# EAGLE board LRA_TestSiteJunctionBox (EAGLE 8.7.1)
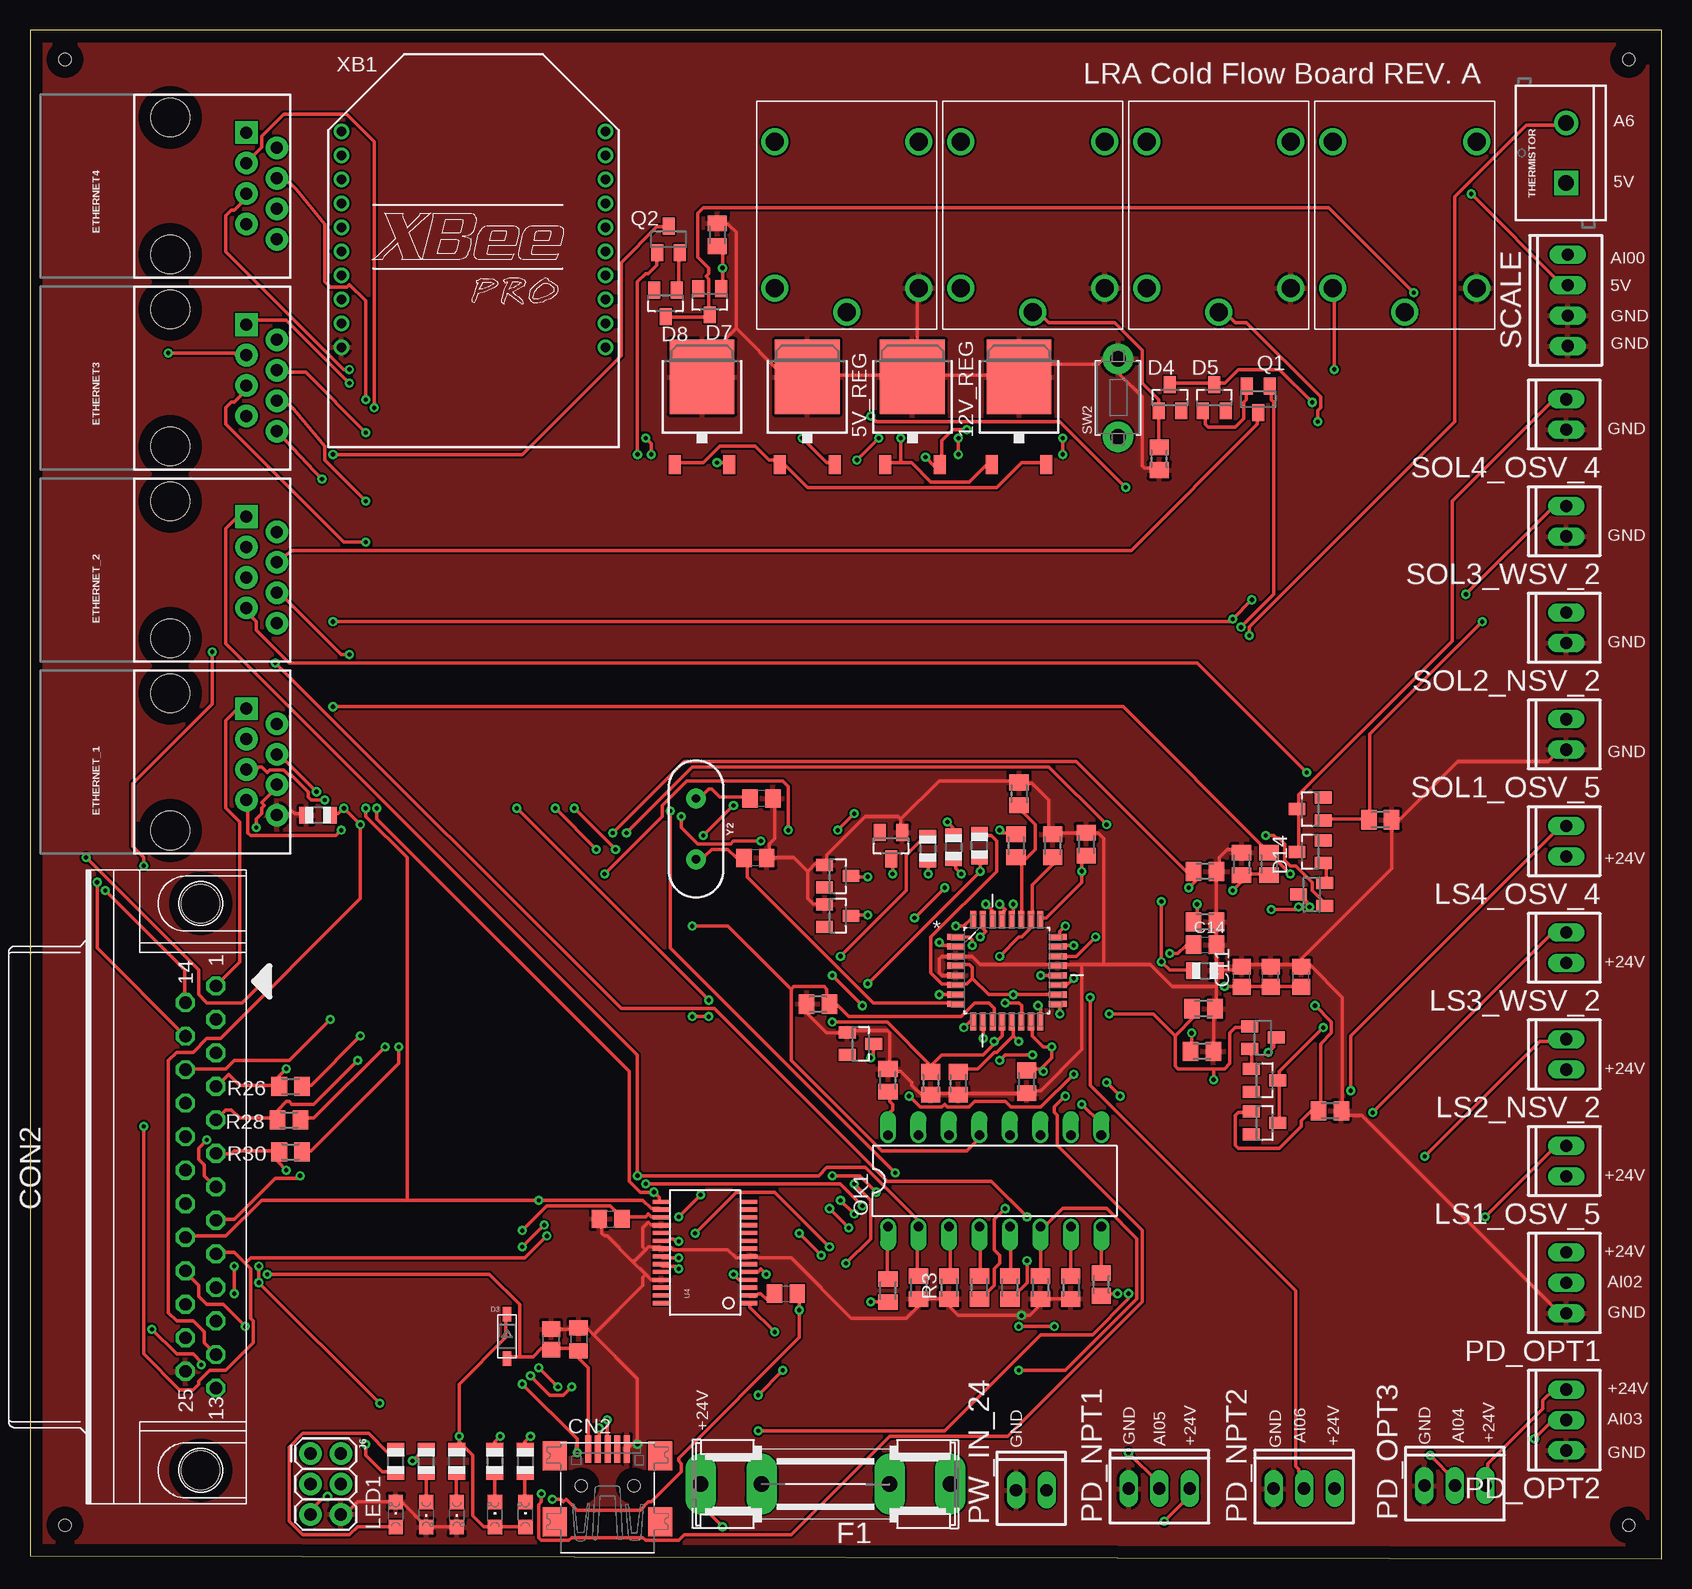
[diagram p2: board, top side]
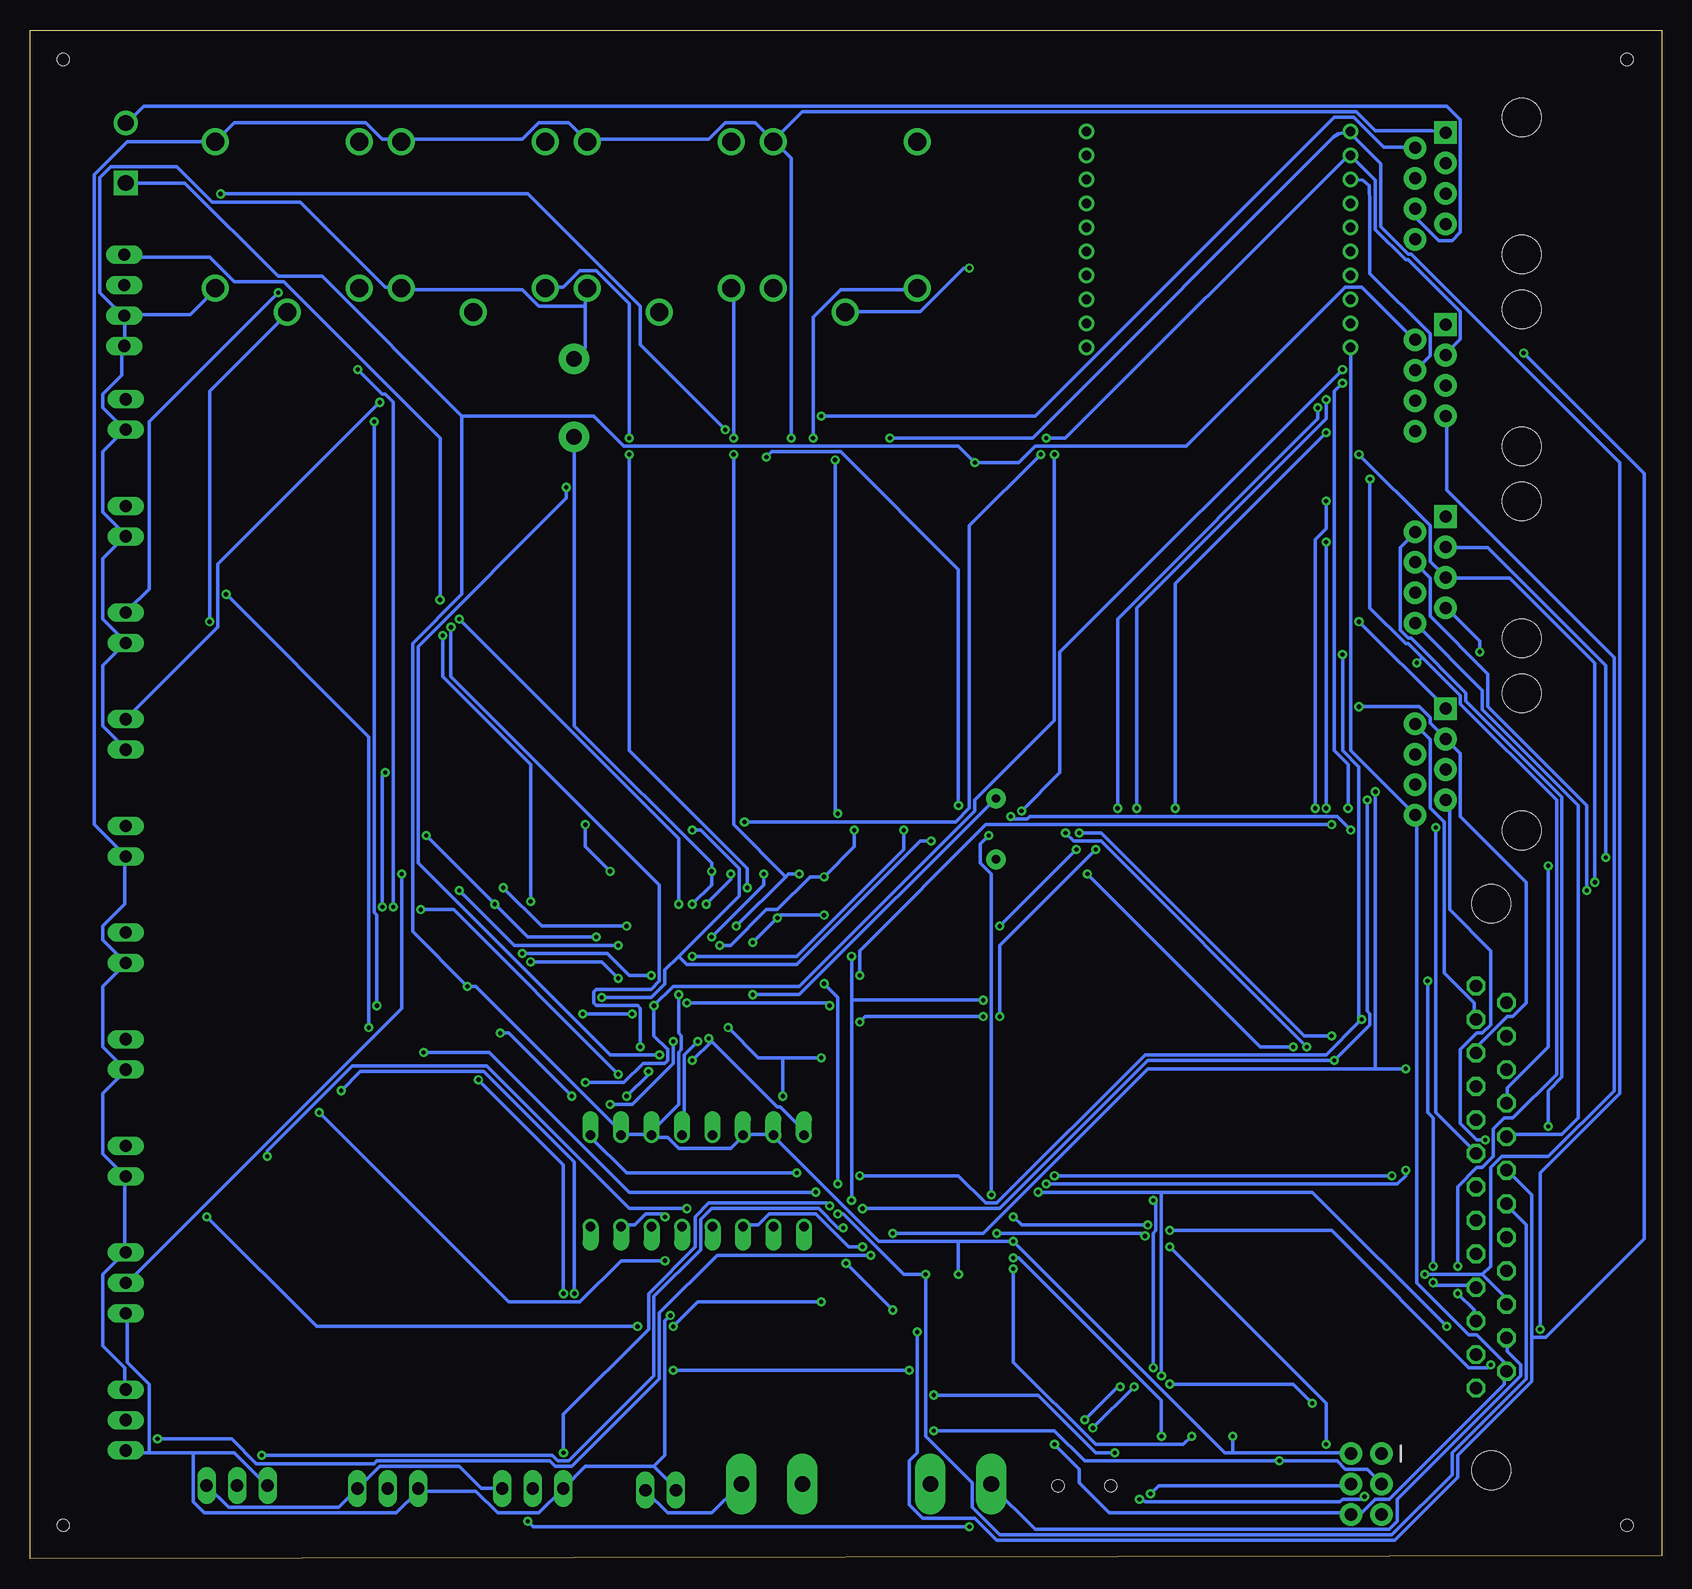
[diagram p3: board, bottom side, seen from below]

Size 136 x 127.43 mm. Coordinates in mm from the lower left corner, seen from the top.
Outline: 0,0.25 136,0 136,127.43 0,127.43 0,0.25
Copper layers (1*16): Top 0.035mm / dielectric 1.5mm / Bottom 0.035mm
Design rules "default": minimum track width 6mil, minimum drill 0.35mm, track to track 6mil, track to pad 6mil, pad to pad 6mil, via to via 6mil, smd to smd 6mil, copper to edge 40mil, drill to drill 6mil, minimum pad ring 10mil, minimum via ring 8mil, stop-mask expansion 4mil, vias tented up to drill 0mil, thermal gap 10mil
Net classes: 0 default: width 0.305 mm; 1 +5V: width 0.61 mm; 2 +12V: width 0.61 mm; 3 5V: width 0.61 mm
Holes 1 mm at 2.92,124.97 133.22,124.97 133.22,2.79 2.92,2.79

## Footprints (pad centres in the part's own frame; a part is rotated, then mirrored left to right if it is on the bottom)
TO252 = smd 1 x 1.6: 1 -2.28,-4.8; 2 2.28,-4.8 | smd 5.4 x 6.2: 3 0,2.5
C0805 = smd 1.3 x 1.5: 1 -0.85,0; 2 0.85,0
0805 = smd 1.27 x 1.524: 1 -0.953,0; 2 0.953,0
USB-MINIB = smd 0.5 x 2.308: D+ 0,4.064; D- -0.8,4.064; GND 1.6,4.064; ID 0.8,4.064; VBUS -1.6,4.064 | smd 2 x 2.4: GND1 -4.4,-2; GND2 -4.4,3.5; GND3 4.4,3.5; GND4 4.4,-2 | hole 1: -2.2,1; 2.2,1
D-25M/90 = drill 1.016 pad 1.575 octagon: 1 16.764,-1.27; 2 13.97,-1.27; 3 11.176,-1.27; 4 8.382,-1.27; 5 5.588,-1.27; 6 2.794,-1.27; 7 0,-1.27; 8 -2.794,-1.27; 9 -5.588,-1.27; 10 -8.382,-1.27; 11 -11.176,-1.27; 12 -13.97,-1.27; 13 -16.764,-1.27; 14 15.367,1.27; 15 12.573,1.27; 16 9.779,1.27; 17 6.985,1.27; 18 4.191,1.27; 19 1.397,1.27; 20 -1.397,1.27; 21 -4.191,1.27; 22 -6.985,1.27; 23 -9.779,1.27; 24 -12.573,1.27; 25 -15.367,1.27 | hole 3.2: 23.622,0; -23.622,0
SOD-123 = smd 1.2 x 0.7: A 1.85,0; C -1.85,0
SOT23 = smd 1 x 1.4: 1 -0.95,-1.1; 2 0.95,-1.1; 3 0,1.1
RJ45-8 = drill 1 pad 1.88 square: 1 -4.445,6.35 | drill 1 pad 1.88: 2 -3.175,8.89; 3 -1.905,6.35; 4 -0.635,8.89; 5 0.635,6.35; 6 1.905,8.89; 7 3.175,6.35; 8 4.445,8.89 | hole 3.2: -5.715,0; 5.715,0
SHK20L = drill 1.321 pad 2.54 long: 1A -10.414,0; 1B -5.334,0; 2A 10.414,0; 2B 5.334,0
2X3 = drill 1.016 pad 1.88: 1 0,0; 2 0,2.54; 3 2.54,0; 4 2.54,2.54; 5 5.08,0; 6 5.08,2.54
CHIPLED_0805 = smd 1.2 x 1.2: A 0,-1.05; C 0,1.05
MTA-100-2V = drill 1.016 long: 1 -1.27,0; 2 1.27,0
DIL16 = drill 0.813 offset: 1 -8.89,-3.81; 2 -6.35,-3.81; 3 -3.81,-3.81; 4 -1.27,-3.81; 5 1.27,-3.81; 6 3.81,-3.81; 7 6.35,-3.81; 8 8.89,-3.81; 9 8.89,3.81; 10 6.35,3.81; 11 3.81,3.81; 12 1.27,3.81; 13 -1.27,3.81; 14 -3.81,3.81; 15 -6.35,3.81; 16 -8.89,3.81
MTA-100-3V = drill 1.016 long: 1 -2.54,0; 2 0,0; 3 2.54,0
M0805 = smd 1.3 x 1.6: 1 -0.95,0; 2 0.95,0
R0805 = smd 1.1 x 1.4: 1 -1,0; 2 1,0
MTA-100-4V = drill 1.016 long: 1 -3.81,0; 2 -1.27,0; 3 1.27,0; 4 3.81,0
TACT_PANA-EVQ = drill 1.3 pad 2.54: P$1 -3.25,0; P$2 3.25,0
SCREWTERMINAL-5MM-2 = drill 1.3 pad 2.032 square: 1 0,0 | drill 1.3 pad 2.032: 2 5,0
QFP80P900X900X120-32N = smd 1.473 x 0.508: 1 -4.242,2.794; 2 -4.242,2.007; 3 -4.242,1.194; 4 -4.242,0.406; 5 -4.242,-0.406; 6 -4.242,-1.194; 7 -4.242,-2.007; 8 -4.242,-2.794; 17 4.242,-2.794; 18 4.242,-2.007; 19 4.242,-1.194; 20 4.242,-0.406; 21 4.242,0.406; 22 4.242,1.194; 23 4.242,2.007; 24 4.242,2.794 | smd 0.508 x 1.473: 9 -2.794,-4.242; 10 -2.007,-4.242; 11 -1.194,-4.242; 12 -0.406,-4.242; 13 0.406,-4.242; 14 1.194,-4.242; 15 2.007,-4.242; 16 2.794,-4.242; 25 2.794,4.242; 26 2.007,4.242; 27 1.194,4.242; 28 0.406,4.242; 29 -0.406,4.242; 30 -1.194,4.242; 31 -2.007,4.242; 32 -2.794,4.242
SSOP28DB = smd 0.348 x 1.397: 1 -4.225,-3.656; 2 -3.575,-3.656; 3 -2.925,-3.656; 4 -2.275,-3.656; 5 -1.625,-3.656; 6 -0.975,-3.656; 7 -0.325,-3.656; 8 0.325,-3.656; 9 0.975,-3.656; 10 1.625,-3.656; 11 2.275,-3.656; 12 2.925,-3.656; 13 3.575,-3.656; 14 4.225,-3.656; 15 4.225,3.656; 16 3.575,3.656; 17 2.925,3.656; 18 2.275,3.656; 19 1.625,3.656; 20 0.975,3.656; 21 0.325,3.656; 22 -0.325,3.656; 23 -0.975,3.656; 24 -1.625,3.656; 25 -2.275,3.656; 26 -2.925,3.656; 27 -3.575,3.656; 28 -4.225,3.656
RW-SH = drill 1.5: 1 -6.1,6; 2 -6.1,-6; COM -8.1,0; NC 6.1,6; NO 6.1,-6
XBEE-PRO = drill 0.8 pad 1.27: 1 -11,9; 2 -11,7; 3 -11,5; 4 -11,3; 5 -11,1; 6 -11,-1; 7 -11,-3; 8 -11,-5; 9 -11,-7; 10 -11,-9; 11 11,-9; 12 11,-7; 13 11,-5; 14 11,-3; 15 11,-1; 16 11,1; 17 11,3; 18 11,5; 19 11,7; 20 11,9
HC49US = drill 0.7 pad 1.651: 1 -2.54,0; 2 2.54,0

## Placement (x,y rotation side)
5V_REG  7824DT  [TO252]  73.53,96.01 0 top
12V_REG  7824DT  [TO252]  82.42,96.01 0 top
C11  0.1uF  [C0805]  100.97,48.51 90 top
C12  15pF  [0805]  60.96,63.37 180 top
C13  15pF  [0805]  60.45,58.42 180 top
C14  0.1uF  [0805]  97.92,51.18 0 top
C15  4.7uF  [C0805]  103.38,48.51 90 top
C16  4.7uF  [C0805]  105.92,48.51 90 top
C17  0.1uF  [0805]  48.39,28.32 0 top
C18  0.1uF  [0805]  62.99,22.1 0 top
C19  4.7uF  [C0805]  43.43,18.29 90 top
C20  0.1uF  [0805]  45.72,18.29 270 top
CN2  [USB-MINIB]  48.13,5.08 0 top
CON2  [D-25M/90]  14.22,30.99 90 top
D3  [SOD-123]  39.75,18.54 270 top
D4  BAS40  [SOT23]  95,96.77 0 top
D5  BAS40  [SOT23]  98.68,96.77 0 top
D6  BAS40  [SOT23]  71.76,59.44 180 top
D7  BAS40  [SOT23]  56.64,104.78 180 top
D8  BAS40  [SOT23]  52.96,104.65 180 top
D9  BAS40  [SOT23]  67.31,56.9 270 top
D10  BAS40  [SOT23]  102.87,36.32 270 top
D11  BAS40  [SOT23]  102.87,39.88 270 top
D12  BAS40  [SOT23]  67.31,53.59 270 top
D13  BAS40  [SOT23]  106.68,62.48 90 top
D14  BAS40  [SOT23]  106.68,58.93 90 top
D15  BAS40  [SOT23]  69.22,42.93 270 top
ETHERNET3  RJ45  [RJ45-8]  11.68,98.43 270 top
ETHERNET4  RJ45  [RJ45-8]  11.68,114.43 270 top
ETHERNET_1  RJ45  [RJ45-8]  11.68,66.42 270 top
ETHERNET_2  RJ45  [RJ45-8]  11.68,82.42 270 top
F1  [SHK20L]  66.29,6.22 180 top
IC1  7824DT  [TO252]  64.77,96.01 0 top
IC2  7824DT  [TO252]  56.01,96.01 0 top
J6  FEMALE 2x3  [2X3]  23.37,8.76 270 top
LED1  [CHIPLED_0805]  30.48,3.68 0 top
LED5  [CHIPLED_0805]  33.02,3.68 180 top
LED6  [CHIPLED_0805]  35.56,3.68 180 top
LED7  [CHIPLED_0805]  41.27,3.68 0 top
LED8  [CHIPLED_0805]  38.73,3.68 0 top
LS1_OSV_5  [MTA-100-2V]  128.02,33.15 90 top
LS2_NSV_2  [MTA-100-2V]  128.02,42.04 90 top
LS3_WSV_2  [MTA-100-2V]  128.02,50.93 90 top
LS4_OSV_4  [MTA-100-2V]  128.02,59.82 90 top
OK1  ILQ1  [DIL16]  80.39,31.5 0 top
PD_NPT1  [MTA-100-3V]  94.11,5.84 0 top
PD_NPT2  [MTA-100-3V]  106.17,5.84 0 top
PD_OPT1  [MTA-100-3V]  128.02,22.99 90 top
PD_OPT2  [MTA-100-3V]  128.02,11.56 90 top
PD_OPT3  [MTA-100-3V]  118.75,6.1 0 top
PW_IN_24  [MTA-100-2V]  83.44,5.71 0 top
Q1  [SOT23]  102.36,96.65 180 top
Q2  [SOT23]  53.21,109.98 0 top
Q3  [SOT23]  102.74,43.43 270 top
Q4  [SOT23]  106.81,55.37 90 top
R1  10k  [M0805]  74.04,22.61 90 top
R2  400  [M0805]  79.12,22.61 270 top
R3  10k  [M0805]  76.58,22.61 90 top
R4  10k  [M0805]  65.66,46.23 0 top
R5  10k  [R0805]  24,61.98 180 top
R6  1k  [R0805]  97.92,49.02 0 top
R7  680  [R0805]  30.48,8.13 90 top
R12  680  [R0805]  79.12,59.44 90 top
R13  100  [R0805]  76.96,59.31 270 top
R14  100  [R0805]  74.8,59.18 270 top
R15  680  [R0805]  33.02,8.13 90 top
R16  680  [R0805]  35.56,8.13 90 top
R17  680  [R0805]  41.27,8.13 270 top
R18  680  [R0805]  38.73,8.13 270 top
R24  3.8K  [M0805]  103.25,57.91 90 top
R25  1K  [M0805]  100.97,57.91 90 top
R26  3.8K  [M0805]  21.72,39.37 180 top
R27  1K  [M0805]  97.92,57.28 0 top
R28  3.8K  [M0805]  21.59,36.58 180 top
R29  1K  [M0805]  88.01,59.56 90 top
R30  3.8K  [M0805]  21.72,33.91 180 top
R31  1K  [M0805]  85.22,59.44 90 top
R32  3.8K  [M0805]  82.17,59.44 90 top
R33  1K  [M0805]  82.42,63.75 90 top
R34  10K  [M0805]  94.11,91.69 270 top
R35  10K  [M0805]  57.28,110.36 90 top
R36  10K  [M0805]  108.33,37.34 0 top
R37  10K  [M0805]  112.52,61.59 0 top
R38  10K  [M0805]  97.66,42.29 0 top
R39  10K  [M0805]  83.06,39.75 270 top
R40  10K  [M0805]  97.79,45.85 0 top
R41  10K  [M0805]  97.92,53.09 0 top
R42  400  [M0805]  71.5,22.35 270 top
R43  10k  [M0805]  71.5,39.88 270 top
R44  400  [M0805]  81.66,22.61 270 top
R45  10k  [M0805]  75.06,39.62 90 top
R46  10k  [M0805]  84.2,22.61 90 top
R47  400  [M0805]  89.28,22.86 270 top
R48  10k  [M0805]  86.74,22.61 90 top
R49  10k  [M0805]  77.34,39.62 90 top
SCALE  [MTA-100-4V]  128.14,104.9 90 top
SOL1_OSV_5  [MTA-100-2V]  128.02,68.71 90 top
SOL2_NSV_2  [MTA-100-2V]  128.02,77.6 90 top
SOL3_WSV_2  [MTA-100-2V]  128.02,86.49 90 top
SOL4_OSV_4  [MTA-100-2V]  128.02,95.38 90 top
SW2  [TACT_PANA-EVQ]  90.68,96.77 90 top
THERMISTOR  [SCREWTERMINAL-5MM-2]  128.02,114.68 90 top
U3  ATMEGA328P-AU  [QFP80P900X900X120-32N]  81.41,49.02 0 top
U4  [SSOP28DB]  56.26,25.53 90 top
U$2  RW-SH  [RW-SH]  83.57,112.01 90 top
U$3  RW-SH  [RW-SH]  68.07,112.01 90 top
U$4  RW-SH  [RW-SH]  99.06,112.01 90 top
U$5  RW-SH  [RW-SH]  114.55,112.01 90 top
XB1  XBEE-PRO  [XBEE-PRO]  36.96,109.98 0 top
Y2  16MHz  [HC49US]  55.5,60.83 270 top

## Tracks (layer width: path | path; a pad name or v marks a point on that pad's centre or on a via)
3.3V  (via drill 0.35)
  Top 0.305: U4.17 52.45,28.5 51.77,28.5 51.54,28.73 51.31,28.5 49.48,28.5 C17.2 49.25,28.5 48.34,29.41 43.08,29.41 v41.02,27.36 | v64.34,93.42 66.4,91.36 66.85,91.36 IC1.2 | v14.27,16.15 14.27,16.38 13.59,17.07 12.22,17.07 v10.16,19.13
  Bottom 0.305: v64.34,93.42 52.45,93.42 27.33,118.54 26.92,118.8 XB1.1 25.42,118.29 23.42,116.28 23.42,111.02 21.13,108.74 20.9,108.74 3.53,91.36 3.53,38.79 10.16,32.16 v10.16,19.13 | v41.02,27.36 27.53,27.36 16.1,15.93 14.5,15.93 v14.27,16.15
5V  (via drill 0.35)
  Top 0.305: v27.99,9.53 27.99,8.61 29.36,7.24 30.28,7.24 R7.1 | v42.85,27.81 v41.02,25.98 | v55.88,30.33 v54.05,28.5 | v58.62,62.79 v56.11,60.27 | v74.62,91.82 75.31,91.14 75.77,91.14 5V_REG.2 76,91.36 76,93.19 76.91,94.11 v78.05,94.11 | v120.12,113.77 127.66,106.22 128.12,106.22 SCALE.3
  Bottom 0.305: v27.99,9.53 27.99,12.95 v41.02,25.98 | v42.85,27.81 53.37,27.81 v54.05,28.5 | v55.88,30.33 55.88,57.07 56.79,57.99 56.79,59.59 v56.11,60.27 | v58.62,62.79 58.62,82.45 68.45,92.28 74.17,92.28 v74.62,91.82 | v120.12,113.77 94.51,113.77 85.14,104.39 85.14,101.19 v78.05,94.11
12V
  Top 0.305: IC2.1 53.82,91.36 56.11,91.36 57.48,92.73 60.45,92.73 61.59,91.59 62.28,91.59 62.51,91.36 IC1.1 62.51,91.14 62.97,91.14 64.8,89.31 80.57,89.31 82.63,91.36 84.68,91.36 12V_REG.2
+5V  (via drill 0.35)
  Top 0.305: v57.25,91.36 58.17,91.36 IC2.2 | R12.2 79.2,60.27 80.11,60.27 80.57,59.82 80.57,57.3 75.08,51.82 75.08,48.84 76,47.93 77.14,47.93 U3.6 77.37,47.93 78.05,47.93 78.51,48.39 | 78.51,48.39 78.51,49.3 78.28,49.53 77.37,49.53 U3.4 | U3.18 v81.94,47.02 79.88,47.02 78.51,48.39 | C16.1 105.72,47.7 103.43,47.7 C15.1 103.2,47.7 101.14,47.7 C11.1 100.91,47.7 v99.54,47.7 | 38.73,2.67 41.25,2.67 LED7.A | 35.76,9.75 35.76,9.3 R16.2 | 35.76,9.75 v35.76,10.21 35.76,14.55 39.65,18.44 39.65,20.27 D3.C | 38.73,2.67 37.82,2.67 36.91,3.58 36.91,8.61 35.76,9.75 | 38.73,2.67 LED8.A | v54.05,26.44 53.82,26.44 53.59,26.67 53.37,26.67 53.14,26.44 52.68,26.44 U4.20 | v58.62,23.7 59.08,23.24 59.77,23.24 U4.4
  Bottom 0.305: ETHERNET3.2 20.68,101.65 25.02,105.99 26.39,105.99 39.65,92.73 52.22,92.73 53.59,91.36 v57.25,91.36 58.62,92.73 86.51,92.73 89.03,95.25 100,95.25 | THERMISTOR.1 123.09,114.68 115.32,106.91 111.66,106.91 100,95.25 | 86.51,35.36 86.74,35.36 OK1.10 86.51,35.36 | 86.51,35.36 84.46,35.36 | 84.46,35.36 84.23,35.36 OK1.11 | 86.51,35.36 98.86,47.7 v99.54,47.7 104.12,52.27 104.12,76.28 100,80.39 100,95.25 | v81.94,47.02 81.94,43.81 81.71,43.59 81.71,42.44 81.94,42.21 81.94,37.87 84.46,35.36 | 84.46,35.36 OK1.11 | 58.62,26.44 65.25,26.44 73.94,35.13 OK1.15 74.17,35.36 76.45,35.36 OK1.14 76.68,35.13 77.6,34.21 81.94,34.21 82.86,35.13 84,35.13 OK1.11 | 58.62,26.44 v54.05,26.44 36.45,8.84 35.76,8.84 | 58.62,26.44 v58.62,23.7 | 35.76,8.84 25.93,8.84 J6.2 | 35.76,8.84 v35.76,10.21
+24V  (via drill 0.35)
  Top 0.305: 72.57,91.36 73.48,91.36 75.08,89.76 78.28,89.76 79.65,91.14 80.11,91.14 12V_REG.1 | 72.57,91.36 71.43,91.36 5V_REG.1 | v72.57,93.42 72.57,91.36 | PD_OPT2.3 126.98,14.1 126.06,13.18 126.06,12.5 121.49,7.92 121.49,6.1 PD_OPT3.3 | F1.2A 55.88,4.5 v57.71,2.67 | v94.51,3.12 96.57,5.18 96.57,5.64 PD_NPT1.3
  Bottom 0.305: ETHERNET4.1 19.18,119.02 23.88,119.02 25.48,120.62 71.65,120.62 73.94,118.34 U$3.NO | U$3.NO 74.17,118.34 75.54,119.71 78.05,119.71 79.43,118.34 89.48,118.34 U$2.NO 89.71,118.34 91.08,119.71 93.6,119.71 94.97,118.34 105.03,118.34 U$4.NO 105.26,118.34 106.63,118.34 108,119.71 118.97,119.71 120.35,118.34 U$5.NO 120.57,118.11 127.89,118.11 130.63,115.37 130.63,61.19 128.12,58.67 LS4_OSV_4.1 128.12,58.45 128.12,54.56 129.95,52.73 129.95,51.59 LS3_WSV_2.1 128.12,49.53 129.95,47.7 129.95,42.67 128.12,40.84 LS2_NSV_2.1 128.12,40.61 129.95,38.79 129.95,33.76 128.12,31.93 LS1_OSV_5.1 128.12,31.7 128.12,25.53 | v72.57,93.42 72.57,116.74 73.94,118.11 U$3.NO | CON2.24 12.9,18.21 12.9,17.3 11.76,16.15 11.76,15.24 22.05,4.95 22.05,3.12 22.73,2.44 52.22,2.44 55.88,6.1 F1.2A | PD_NPT1.3 96.8,5.87 98.4,5.87 100.23,7.7 106.86,7.7 PD_NPT2.3 110.29,4.27 119.43,4.27 121.26,6.1 PD_OPT3.3 | 128.12,25.53 129.95,23.7 129.95,17.75 128.12,15.93 128.12,14.1 PD_OPT2.3 | 128.12,25.53 PD_OPT1.3 | v57.71,2.67 94.06,2.67 v94.51,3.12
ARD_D0_RX  (via drill 0.35)
  Top 0.305: v62.05,18.9 59.99,20.95 59.99,21.18 U4.1 | v76.45,61.42 76.91,60.96 76.91,60.5 R13.1 | v51.77,92.05 51.77,92.96 v51.31,93.42 | v11.53,100.51 17.02,100.51 17.25,100.28 17.93,100.28 ETHERNET3.3
  Bottom 0.305: v62.05,18.9 62.05,8.84 62.74,8.15 62.74,4.5 61.59,3.35 57.25,3.35 55.42,1.52 22.28,1.52 17.02,6.78 17.02,8.61 10.85,14.78 10.85,18.44 | 10.85,18.44 10.85,30.33 12.9,32.38 CON2.19 | v76.45,61.42 58.85,61.42 57.71,62.56 57.71,86.11 v51.77,92.05 | v51.31,93.42 49.71,93.42 26.16,116.97 XB1.2 25.93,116.97 23.88,114.91 23.88,110.8 21.36,108.28 21.13,108.28 16.79,103.94 16.79,101.65 17.93,100.51 ETHERNET3.3 | 10.85,18.44 9.7,18.44 1.47,26.67 1.47,90.45 v11.53,100.51
ARD_D1_TX  (via drill 0.35)
  Top 0.305: v61.37,23.7 60.91,24.16 60.68,23.93 59.99,23.93 U4.5 | v67.54,50.22 73.03,55.7 73.03,58.67 74.4,60.05 74.62,60.05 R14.1 | v68.68,28.73 v67.54,29.87 | v27.99,93.88 22.96,98.91 21.44,98.91 ETHERNET3.4 | v56.57,46.56 v40.56,62.56
  Bottom 0.305: XB1.3 24.92,114.91 24.41,114.45 24.33,112.85 24.33,107.14 19.3,102.11 19.3,100.28 20.45,99.14 ETHERNET3.4 | CON2.20 12.9,29.41 11.3,27.81 11.3,15.01 17.48,8.84 17.48,7.01 22.5,1.98 55.19,1.98 57.48,4.27 57.48,6.32 61.37,10.21 v61.37,23.7 63.2,23.7 68.22,28.73 v68.68,28.73 | v67.54,29.87 67.54,46.56 | 67.54,46.56 v67.54,50.22 | v27.99,93.88 40.56,81.31 v40.56,62.56 | 67.54,46.56 v56.57,46.56
ARD_EN_DAC_DO00  (via drill 0.35)
  Top 0.305: v100.91,77.65 103.66,80.39 103.66,96.39 103.43,96.62 103.43,97.54 Q1.1 | 84.23,40.84 85.14,41.76 v85.14,42.67 84.46,42.67 83.54,43.59 83.54,44.73 U3.15 | 84.23,40.84 83.08,40.84 R39.1 | v42.62,5.41 42.62,4.72 42.39,4.5 42.39,1.75 42.62,1.52 44.91,1.52 45.14,1.75 51.08,1.75 51.31,1.52 54.05,1.52 54.51,1.98 63.42,1.98 71.65,10.21 81.48,10.21 92.69,21.41 92.69,27.36 85.6,34.44 85.6,36.96 85.37,37.19 85.37,37.64 v86.28,38.56 | 84.23,40.84 v84.46,40.61
  Bottom 0.305: v100.91,77.65 100.91,73.53 83.54,56.16 83.54,48.16 84.23,47.47 88.8,47.47 89.03,47.24 89.03,46.33 88.8,46.1 85.37,46.1 85.14,45.87 v85.14,42.67 | v42.62,5.41 41.94,6.1 25.93,6.1 J6.4 | v86.28,38.56 84.46,40.39 v84.46,40.61
ARD_EN_DAC_DO01  (via drill 0.35)
  Top 0.305: v50.62,92.05 50.62,106.45 51.31,107.14 51.54,107.14 52.22,107.82 52.22,108.74 Q2.1 | v84,46.1 84.23,45.87 84.23,44.96 U3.16 | v96.8,43.81 96.8,42.44 R38.1 | v89.71,39.7 v90.86,38.56
  Bottom 0.305: v50.62,92.05 50.62,69.88 57.25,63.25 57.25,62.33 71.88,47.7 82.4,47.7 v84,46.1 84,43.59 82.86,42.44 82.86,41.53 83.08,41.3 84.91,41.3 86.51,39.7 v89.71,39.7 | v96.8,43.81 96.11,43.81 v90.86,38.56
ARD_EN_DAC_DO02  (via drill 0.35)
  Top 0.305: v31.88,8.15 32.79,9.07 33.02,9.07 R15.2 | 98.63,40.84 95.66,40.84 95.43,41.07 95.43,43.59 | 98.63,40.84 99.54,40.84 100,41.3 100,43.81 100.46,44.27 101.6,44.27 Q3.1 | 95.43,43.59 97.03,45.19 97.03,45.64 R40.1 | v85.83,45.41 85.83,46.1 U3.17 | v89.94,45.41 93.6,45.41 95.43,43.59 | v60.68,10.67 76.23,10.67 84.23,18.67 88.57,18.67 91.54,21.64 v91.54,22.1 | 98.63,40.84 v98.63,39.93
  Bottom 0.305: J6.3 23.42,6.32 24.56,7.47 26.39,7.47 27.08,8.15 v31.88,8.15 48.11,8.15 50.62,10.67 v60.68,10.67 | v89.94,45.41 v85.83,45.41 | v91.54,22.1 91.54,32.84 v98.63,39.93
ARD_EN_DAC_DO03  (via drill 0.35)
  Top 0.305: v102.97,60.27 103.66,60.27 103.89,60.05 104.12,60.05 104.57,59.59 104.57,58.22 105.03,57.76 105.49,57.76 106.86,56.39 106.86,55.7 107.77,54.79 107.77,54.56 Q4.1 | v97.26,54.56 97.26,53.42 97.03,53.19 R41.1 | U3.22 87.2,50.22 v88.8,51.82
  Bottom 0.305: v102.97,60.27 v97.26,54.56 94.51,51.82 v88.8,51.82
ARD_LS1_OSV_5_D6  (via drill 0.35)
  Top 0.305: v79.43,43.36 79.43,44.73 U3.10 | R43.2 71.65,38.79 71.65,38.1 71.88,37.87 71.88,37.41 71.65,37.19 71.65,35.36 OK1.16 | v70.05,95.25 70.51,94.79 85.83,94.79 v91.31,89.31 | v83.54,41.99 81.26,41.99 v80.8,41.53
  Bottom 0.305: 79.2,43.13 73.71,37.64 73.48,37.64 71.65,35.81 71.65,35.36 OK1.16 | v70.05,95.25 52.22,95.25 27.3,120.17 25.7,120.17 23.19,117.65 20.68,117.65 ETHERNET4.2 | v91.31,89.31 91.31,88.39 103.66,76.05 103.66,57.99 87.66,41.99 v83.54,41.99 | 79.2,43.13 v80.8,41.53 | 79.2,43.13 v79.43,43.36
ARD_LS2_NSV_2_D7  (via drill 0.35)
  Top 0.305: U3.11 80.34,44.96 80.34,45.87 79.88,46.33 78.74,46.33 77.6,45.19 68.22,45.19 67.31,46.1 66.62,46.1 R4.2 66.4,46.33 66.4,47.47 66.17,47.7 63.65,47.7 63.42,47.47 | 63.42,47.47 63.42,41.53 70.97,33.98 78.05,33.98 78.97,34.9 78.97,35.13 OK1.13 | v28.68,95.94 28.68,118.11 26.39,120.4 21.13,120.4 19.3,118.57 19.3,117.65 18.16,116.51 ETHERNET4.3 | v48.79,59.13 v45.36,62.56 | v55.19,52.73 58.17,52.73 63.42,47.47
  Bottom 0.305: v28.68,95.94 28.68,95.02 45.36,78.33 v45.36,62.56 | v55.19,52.73 v48.79,59.13
ARD_LS3_WSV_2_D8  (via drill 0.35)
  Top 0.305: 80.57,43.13 79.43,41.99 76,41.99 75.08,41.07 | 80.57,43.13 81.03,43.59 81.03,44.73 U3.12 | 75.08,41.07 75.08,40.61 R45.2 75.08,41.07 | 80.57,43.13 v80.34,43.13 | v27.99,96.62 27.99,104.85 26.62,106.22 26.39,105.99 25.02,105.99 24.56,106.45 24.56,111.25 22.17,114.15 21.69,114.66 ETHERNET4.4 | v47.19,59.13 v43.76,62.56 | v56.57,45.19 v55.19,45.19 | v66.85,44.73 71.43,44.73 75.08,41.07
  Bottom 0.305: v80.34,43.13 81.48,41.99 81.48,35.36 OK1.12 | v27.99,96.62 27.99,95.02 43.76,79.25 v43.76,62.56 | v47.19,59.13 55.19,51.13 v55.19,45.19 | v56.57,45.19 66.4,45.19 v66.85,44.73
ARD_LS4_OSV_4_D9  (via drill 0.35)
  Top 0.305: 81.94,43.59 81.94,44.73 U3.13 | 81.94,43.59 80.57,42.21 80.34,42.21 78.97,40.84 77.6,40.84 77.37,40.61 R49.2 | v87.66,37.87 89.26,36.27 89.26,35.36 OK1.9 | 81.94,43.59 v82.4,43.13 | v26.62,99.14 26.16,99.14 16.33,108.97 16.33,111.94 16.79,112.4 17.02,112.4 17.93,113.31 17.93,113.77 ETHERNET4.5 | v53.37,62.33 53.37,50.9 v72.11,32.16
  Bottom 0.305: v87.66,37.87 85.83,37.87 82.4,41.3 v82.4,43.13 | v26.62,99.14 50.16,75.59 50.16,65.53 v53.37,62.33 | v72.11,32.16 86.28,32.16 89.26,35.13 OK1.9
ARD_PD_NPT1_A3  (via drill 0.35)
  Top 0.305: R31.1 85.37,58.45 85.37,57.99 83.54,56.16 83.54,53.42 U3.26 83.31,53.19 83.31,52.5 82.63,51.82 82.4,51.82 v80.8,50.22 | v30.73,42.67 30.73,41.3 23.42,33.98 22.73,33.98 R30.1 | v47.88,57.07 52.68,61.87 52.68,62.79 54.74,64.85 62.74,64.85 63.2,64.39 v63.2,60.73
  Bottom 0.305: v30.73,42.67 33.48,42.67 v47.88,57.07 | v63.2,60.73 63.2,59.13 72.11,50.22 v80.8,50.22
ARD_PD_NPT2_A4
  Top 0.305: 82.4,58.22 82.17,58.45 R32.1 82.4,58.22 | 82.4,58.22 82.63,57.99 82.63,53.42 U3.27 | 82.4,58.22 82.86,58.22 83.77,59.13 83.77,61.19 82.63,62.33 82.63,62.79 R33.1
ARD_PD_OPT1_A0  (via drill 0.35)
  Top 0.305: v86.97,51.13 85.83,51.13 U3.23 | v100.23,55.7 100.91,56.39 100.91,56.84 R25.1 101.14,57.07 103.2,57.07 R24.1
  Bottom 0.305: v86.97,51.13 95.66,51.13 v100.23,55.7
ARD_PD_OPT2_A1  (via drill 0.35)
  Top 0.305: v86.28,52.73 85.83,52.27 85.83,51.82 U3.24 | v96.57,55.93 97.26,56.62 97.26,56.84 97.03,57.07 R27.1 96.8,57.3 96.34,57.3 87.2,66.45 54.51,66.45 v48.56,60.5 | v27.53,43.59 23.42,39.47 22.73,39.47 R26.1
  Bottom 0.305: v86.28,52.73 93.37,52.73 v96.57,55.93 | v27.53,43.59 29.82,43.59 46.74,60.5 v48.56,60.5
ARD_PD_OPT3_A2  (via drill 0.35)
  Top 0.305: U3.25 84.23,53.42 84.68,53.42 87.66,56.39 v87.66,57.3 87.66,58.22 87.88,58.45 R29.1 | v29.59,42.67 23.65,36.73 22.73,36.73 R28.1 | v49.71,60.5 55.19,65.99 84.91,65.99 v89.71,61.19
  Bottom 0.305: v29.59,42.67 46.74,59.82 49.02,59.82 v49.71,60.5 | v89.71,61.19 89.71,59.36 v87.66,57.3
ARD_SOL1_OSV_5_D2  (via drill 0.35)
  Top 0.305: v71.88,57.07 71.88,58.22 D6.3 | v77.14,52.73 77.83,52.73 78.51,53.42 U3.32 | v77.37,92.05 v77.37,93.42
  Bottom 0.305: v71.88,57.07 72.8,57.07 73.03,56.84 | v77.14,52.73 73.03,56.84 | v77.37,93.42 77.37,105.77 U$2.1 | v77.37,92.05 77.37,61.19 73.03,56.84
ARD_SOL2_NSV_2_D3  (via drill 0.35)
  Top 0.305: v69.83,56.84 68.45,56.84 D9.3 | v78.51,51.13 78.51,51.59 78.28,51.82 U3.1 | v68.91,91.59 v70.74,93.42 | v67.31,60.73 v68.68,62.1
  Bottom 0.305: v78.51,51.13 77.6,51.13 74.62,54.1 73.71,54.1 70.97,56.84 v69.83,56.84 67.31,59.36 v67.31,60.73 | v70.74,93.42 70.74,103.48 68.45,105.77 62.28,105.77 U$3.1 | v68.91,91.59 68.91,62.33 v68.68,62.1
ARD_SOL3_WSV_2_D4  (via drill 0.35)
  Top 0.305: v69.83,53.64 68.45,53.64 D12.3 | v75.77,51.36 76,51.13 77.14,51.13 U3.2 | v86.06,92.05 v86.06,93.42 | v73.71,53.42 v76.23,55.93
  Bottom 0.305: v69.83,53.64 73.48,53.64 v73.71,53.42 v75.77,51.36 | v86.06,93.42 86.06,104.62 88.8,107.37 90.17,107.37 91.54,105.99 92.91,105.99 U$4.1 | v86.06,92.05 86.06,67.36 76.23,57.53 v76.23,55.93
ARD_SOL4_OSV_4_D5  (via drill 0.35)
  Top 0.305: v70.05,41.76 70.28,41.99 70.28,42.9 D15.3 | v77.83,44.27 78.51,44.96 U3.9 | v108.69,99.14 108.69,105.77 U$5.1 | v105.72,54.33 105.49,54.1 v103.43,54.1 | v86.97,40.39 84.23,37.64 81.71,37.64 81.26,38.1 78.74,38.1 78.28,37.64 76.45,37.64 76.23,37.87 76,37.64 74.17,37.64 v73.25,38.56
  Bottom 0.305: 73.25,41.76 75.31,41.76 v77.83,44.27 | 73.25,41.76 v70.05,41.76 | v108.69,99.14 106.63,97.08 106.4,97.08 105.72,96.39 v105.72,54.33 | v103.43,54.1 100.69,54.1 v86.97,40.39 | 73.25,41.76 v73.25,38.56
ARD_THERM_A6  (via drill 0.35)
  Top 0.305: v86.97,48.39 86.28,47.7 85.83,47.7 U3.19 | R6.1 96.8,49.07 94.97,49.07 v94.29,49.76 v94.29,54.79 | v101.6,76.96 101.6,77.65 118.75,94.79 118.75,113.54 124.69,119.48 127.89,119.48 THERMISTOR.2
  Bottom 0.305: v94.29,49.76 88.34,49.76 v86.97,48.39 | ETHERNET4.6 20.45,112.4 20.45,111.71 18.62,109.88 17.48,109.88 16.79,110.57 16.79,119.94 17.93,121.08 126.52,121.08 127.89,119.71 THERMISTOR.2 | v94.29,54.79 94.29,66.22 101.6,73.53 v101.6,76.96
AREF  (via drill 0.35)
  Top 0.305: v84.23,48.62 U3.20 | v94.97,50.44 95.66,50.44 96.34,51.13 96.8,51.13 C14.1
  Bottom 0.305: v84.23,48.62 86.06,48.62 87.88,50.44 v94.97,50.44
DAC_AI00/ARD_A5  (via drill 0.35)
  Top 0.305: CON2.1 15.65,47.93 17.48,49.76 17.48,61.42 16.33,62.56 16.33,69.88 17.25,70.79 17.93,70.79 ETHERNET_1.1 | v81.94,54.56 81.94,53.42 U3.28 | v101.83,79.93 v100.23,78.33 100,78.11 v25.25,78.11
  Bottom 0.305: v81.94,54.56 81.94,60.05 v100.23,78.33 | v101.83,79.93 101.83,93.42 114.86,106.45 118.97,106.45 121.03,108.51 128.12,108.51 SCALE.4 | v25.25,78.11 18.16,71.02 ETHERNET_1.1
DAC_AI01
  Bottom 0.305: CON2.2 15.65,44.96 15.65,46.33 18.16,48.84 18.16,61.42 19.3,62.56 19.3,68.28 20.45,69.42 ETHERNET_1.2
DAC_AI02  (via drill 0.35)
  Top 0.305: v105.03,57.07 103.43,58.67 R24.2 103.2,58.9 91.08,71.02 v25.25,71.02
  Bottom 0.305: CON2.3 15.42,42.21 15.42,42.67 12.9,45.19 12.45,45.19 11.3,46.33 11.3,56.39 16.79,61.87 16.79,67.13 17.93,68.28 ETHERNET_1.3 18.16,68.5 19.3,69.65 19.3,70.1 20.22,71.02 v25.25,71.02 | v105.03,57.07 105.03,45.87 127.89,23.01 PD_OPT1.2
DAC_AI03  (via drill 0.35)
  Top 0.305: 20.68,39.47 17.48,39.47 16.56,40.39 15.65,39.47 CON2.4 | v125.37,9.98 126.75,11.35 127.89,11.35 PD_OPT2.2 | v64.11,27.13 v65.94,25.3 | v21.36,40.84 20.68,40.16 20.68,39.47 | 20.68,39.47 R26.2 | v23.88,63.93 20.9,66.9 20.68,66.9 ETHERNET_1.4
  Bottom 0.305: v125.37,9.98 119.2,9.98 117.15,7.92 107.32,7.92 107.09,8.15 92.69,8.15 92.23,7.7 90.86,7.7 83.54,15.01 83.54,20.5 78.74,25.3 v65.94,25.3 | v64.11,27.13 56.57,27.13 42.85,40.84 23.88,40.84 | v21.36,40.84 23.88,40.84 | 23.88,40.84 v23.88,63.93
DAC_AI04  (via drill 0.35)
  Top 0.305: CON2.5 16.33,37.41 16.79,37.41 17.48,36.73 20.45,36.73 R28.2 20.68,36.73 20.68,37.41 21.36,38.1 21.59,38.1 21.82,37.87 23.65,37.87 v27.3,41.53 | PD_OPT3.2 118.75,6.55 v116.69,8.61 | v66.62,29.19 v68.22,27.58 | v24.56,63.25 23.42,63.25 23.19,63.48 23.19,63.93 21.82,65.3 21.59,65.3 21.13,65.76 19.99,65.76 19.76,65.53 19.3,65.99 19.07,65.99 18.85,65.76 18.16,65.76 ETHERNET_1.5
  Bottom 0.305: v116.69,8.61 92.46,8.61 92,8.15 91.08,8.15 84,15.24 84,21.87 80.11,25.76 80.11,28.27 79.2,29.19 70.28,29.19 68.68,27.58 v68.22,27.58 | v66.62,29.19 55.19,29.19 42.85,41.53 v27.3,41.53 24.33,44.5 24.33,45.41 24.56,45.64 v24.56,63.25
DAC_AI05  (via drill 0.35)
  Top 0.305: CON2.6 15.65,33.76 16.79,33.76 17.02,33.98 20.68,33.98 R30.2 20.68,33.76 20.68,33.07 v21.36,32.38 | v91.54,8.84 94.06,6.32 94.06,5.87 PD_NPT1.2 | v69.37,29.41 67.54,31.24 v51.31,31.24 | v18.85,60.96 18.85,61.65 19.3,62.1 19.3,62.56 19.53,62.79 19.3,63.02 20.45,64.16 20.45,64.39 ETHERNET_1.6
  Bottom 0.305: v91.54,8.84 91.54,12.04 84.46,19.13 84.46,22.1 80.57,25.98 80.57,28.5 79.43,29.64 69.6,29.64 v69.37,29.41 | v51.31,31.24 22.05,31.24 21.36,31.93 v21.36,32.38 | v18.85,60.96 18.85,37.19 15.65,33.98 CON2.6
DAC_AI06  (via drill 0.35)
  Top 0.305: v14.73,34.9 14.05,34.21 14.05,33.3 14.5,32.84 14.5,31.93 15.42,31.01 CON2.7 | v80.8,60.73 81.03,60.5 82.17,60.5 R32.2 | v88.34,46.79 88.34,39.47 105.49,22.33 105.49,7.7 105.72,7.47 105.72,7.24 106.17,6.78 PD_NPT2.2 | v25.93,60.73 25.48,60.27 18.39,60.27 18.16,60.5 18.16,63.25 ETHERNET_1.7 | v54.28,61.87 54.28,60.96 55.65,59.59 58.39,59.59 58.62,59.82 v60.91,59.82
  Bottom 0.305: v14.73,34.9 15.42,34.9 16.79,36.27 16.79,42.44 15.42,43.81 14.96,43.81 14.27,44.5 14.27,50.67 17.7,54.1 17.7,63.02 17.93,63.25 ETHERNET_1.7 | v80.8,60.73 80.11,60.73 76.91,57.53 76.91,55.24 81.94,50.22 | 81.94,50.22 83.08,49.07 83.08,47.93 84.23,46.79 v88.34,46.79 | v25.93,60.73 27.08,61.87 52.68,61.87 52.91,61.65 54.05,61.65 v54.28,61.87 | v60.91,59.82 61.82,59.82 72.11,49.53 81.26,49.53 81.94,50.22
DAC_DI00  (via drill 0.35)
  Top 0.305: R1.2 73.94,23.7 73.94,27.58 OK1.2 73.94,27.81 73.94,28.27 69.6,32.61 66.4,32.61 65.71,31.93 v50.62,31.93 50.62,41.99 16.33,76.28 16.33,85.88 17.25,86.79 17.93,86.79 ETHERNET_2.1 | v22.5,31.93 22.28,31.7 20.45,31.7 17.02,28.27 15.65,28.27 CON2.8
  Bottom 0.305: v50.62,31.93 v22.5,31.93
DAC_DI01  (via drill 0.35)
  Top 0.305: R3.2 76.68,23.7 76.68,27.58 OK1.3 | 17.93,24.61 18.39,24.16 18.39,20.04 18.62,19.81 18.62,17.98 16.33,15.7 14.96,15.7 14.05,14.78 14.05,14.55 13.59,14.1 12.45,14.1 9.47,17.07 v9.47,36.04 | 17.93,24.61 17.02,25.53 15.65,25.53 CON2.9 | v66.62,25.98 62.05,30.56 58.85,30.56 v55.42,27.13 | v43.08,26.9 41.25,25.07 18.39,25.07 17.93,24.61
  Bottom 0.305: v9.47,36.04 9.47,39.01 8.33,40.16 8.33,63.48 16.33,71.48 16.33,72.16 20.9,76.73 21.13,76.73 21.82,77.42 21.82,84.28 20.68,85.42 ETHERNET_2.2 | v66.62,25.98 67.77,25.98 70.51,28.73 74.4,28.73 75.31,27.81 76.45,27.81 OK1.3 | v55.42,27.13 43.31,27.13 v43.08,26.9
DAC_DI02  (via drill 0.35)
  Top 0.305: R46.2 84.23,23.7 84.23,27.58 OK1.6 84.23,27.81 84.68,27.81 86.06,29.19 89.71,29.19 92.23,26.67 92.23,21.64 86.28,15.7 v82.4,15.7 | v19.07,24.38 v19.07,23.01 v29.13,12.95 | v19.53,48.16 17.7,46.33 14.73,46.33 14.05,47.02 14.05,49.07 v4.67,58.45 | v60.68,13.64 v62.74,15.7 | v45.59,8.84 45.59,9.98 v41.02,14.55
  Bottom 0.305: v19.07,23.01 18.85,22.78 15.65,22.78 CON2.10 | v19.07,24.38 19.07,36.73 19.53,37.19 v19.53,48.16 | v4.67,58.45 4.67,74.45 14.5,84.28 17.93,84.28 ETHERNET_2.3 | v62.74,15.7 v82.4,15.7 | v60.68,13.64 51.99,13.64 47.19,8.84 v45.59,8.84 | v41.02,14.55 30.73,14.55 v29.13,12.95
DAC_DI03  (via drill 0.35)
  Top 0.305: OK1.7 R48.2 | v17.02,24.38 v17.02,22.1 | v24.33,89.99 20.7,93.88 ETHERNET3.8 | v83.08,28.5 80.11,31.47 71.43,31.47 57.02,45.87 49.25,45.87 v20.45,74.68
  Bottom 0.305: v17.02,22.1 15.65,20.73 15.65,19.81 CON2.11 | v17.02,24.38 17.02,31.01 15.42,32.61 14.96,32.61 14.05,33.53 14.05,35.81 13.13,36.73 12.45,36.73 8.79,40.39 8.79,63.25 16.79,71.25 16.79,71.93 19.99,75.13 | 19.99,75.13 21.13,76.28 21.36,76.28 24.33,79.25 v24.33,89.99 | v83.08,28.5 83.31,28.73 84.68,28.73 85.6,27.81 86.74,27.81 OK1.7 | 19.99,75.13 v20.45,74.68
DAC_DO00  (via drill 0.35)
  Top 0.305: Q1.3 102.29,95.48 102.29,94.56 91.77,84.05 21.82,84.05 20.68,83.16 ETHERNET_2.4 | v6.27,55.7 12.9,49.07 12.9,46.56 CON2.14
  Bottom 0.305: v6.27,55.7 6.27,62.79 14.5,71.02 14.5,73.76 19.3,78.56 19.3,81.76 20.45,82.91 ETHERNET_2.4
DAC_DO01  (via drill 0.35)
  Top 0.305: v25.25,92.05 41.02,92.05 49.25,100.28 49.25,108.05 52.22,111.02 53.14,111.02 Q2.3 | v5.59,56.39 5.59,50.9 12.9,43.59 CON2.15
  Bottom 0.305: v25.25,92.05 19.3,86.11 19.3,83.13 18.16,81.99 ETHERNET_2.5 17.93,81.76 12.68,81.76 5.59,74.68 v5.59,56.39
DAC_DO02  (via drill 0.35)
  Top 0.305: v103.2,42.21 103.66,42.67 103.66,43.36 Q3.3 | v70.51,30.56 69.14,31.93 v66.85,31.93 | v25.02,44.96 21.59,41.53 17.02,41.53 16.33,40.84 13.13,40.84 CON2.16 | v26.62,75.36 25.93,75.36 20.9,80.39 20.68,80.39 ETHERNET_2.6
  Bottom 0.305: v103.2,42.21 97.71,42.21 86.06,30.56 v70.51,30.56 | v66.85,31.93 58.62,31.93 56.34,29.64 55.42,29.64 43.08,41.99 27.99,41.99 25.25,44.73 | v26.62,75.36 26.62,67.36 25.25,65.99 25.25,44.73 | 25.25,44.73 v25.02,44.96
DAC_DO03  (via drill 0.35)
  Top 0.305: v106.63,54.33 106.4,54.56 106.4,54.79 105.94,55.24 105.72,55.24 Q4.3 | v106.4,65.53 97.26,74.68 21.59,74.68 18.85,77.42 18.85,78.11 18.16,78.79 18.16,79.25 ETHERNET_2.7 | v9.47,57.76 9.47,58.45 8.56,59.36 8.56,64.62 15.19,71.25 v15.19,75.59
  Bottom 0.305: v106.63,54.33 106.63,65.3 v106.4,65.53 | v9.47,57.76 9.47,42.67 12.9,39.24 12.9,38.1 CON2.17 | v15.19,75.59 15.19,76.51 17.93,79.25 ETHERNET_2.7
DAC_DO04
  Bottom 0.305: CON2.18 12.9,35.36 8.33,35.36 6.96,36.73 6.96,62.79 14.96,70.79 14.96,72.39 20.45,77.88 ETHERNET_2.8
GND  (via drill 0.35)
  Top 0.305: 33.02,2.67 35.53,2.67 LED6.C | 33.02,2.67 30.96,4.72 30.5,4.72 LED1.C 30.28,4.72 27.3,4.72 26.39,3.81 25.93,3.81 J6.6 | 33.02,2.67 LED5.C | R5.2 22.96,62.1 22.05,62.1 21.82,62.33 21.36,61.87 20.68,61.87 ETHERNET_1.8 | C19.2 43.54,19.13 45.59,19.13 C20.1 45.82,19.13 46.51,19.13 46.96,18.67 | 50.39,9.75 50.62,9.98 50.62,15.01 46.96,18.67 | 50.39,9.75 49.94,9.3 CN2.GND | R48.1 84.23,21.64 R46.1 84,21.64 84,20.95 83.31,20.27 v82.63,20.27 77.37,20.27 76.68,20.95 76.68,21.64 R3.1 76.45,21.64 74.17,21.64 R1.1 73.94,21.64 73.94,20.95 73.03,20.04 68.45,20.04 63.42,25.07 60.68,25.07 60.45,25.3 59.99,25.3 U4.7 59.77,25.07 58.85,25.07 58.17,25.76 53.59,25.76 53.37,25.98 53.14,25.76 52.68,25.76 U4.21 52.45,25.98 51.54,25.98 51.31,25.76 | 50.16,24.84 48.11,26.9 47.88,26.9 47.65,27.13 47.65,28.27 C17.1 | 50.16,24.84 51.31,23.7 | 51.31,23.7 51.77,23.24 52.45,23.24 U4.25 | 51.31,25.76 50.39,24.84 50.16,24.84 | 51.31,25.76 51.08,25.98 51.08,27.58 51.54,28.04 51.77,27.81 52.45,27.81 U4.18 | 46.96,18.67 51.08,22.78 51.08,23.47 51.31,23.7 | R34.2 94.06,90.91 92.91,90.91 92.69,91.14 92.69,96.85 90.86,98.68 90.86,99.82 SW2.P$2 90.63,100.05 89.48,100.05 89.03,99.59 83.54,99.59 82.63,98.68 12V_REG.3 82.4,98.68 73.71,98.68 | 73.71,98.68 73.94,98.91 73.94,105.77 U$3.2 | 73.71,98.68 5V_REG.3 73.48,98.68 64.8,98.68 IC1.3 64.57,98.68 62.74,98.68 58.85,102.57 | 58.85,102.57 58.85,110.57 58.17,111.25 57.48,111.25 R35.2 | 58.85,102.57 56.11,99.82 56.11,98.68 IC2.3 | 64.8,57.3 64.8,55.02 65.25,54.56 66.17,54.56 D12.1 | 64.8,57.3 65.48,57.99 66.17,57.99 D9.1 66.4,57.99 66.4,58.67 69.6,61.87 72.34,61.87 72.57,61.65
  Top 0.305: 72.57,61.65 72.57,60.73 D6.1 | 61.59,58.45 63.65,58.45 64.8,57.3 | 61.59,58.45 61.59,59.59 62.05,60.05 62.05,63.25 C12.1 | 61.59,58.45 C13.1 | 72.57,61.65 75.77,64.85 82.4,64.85 R33.2 82.63,64.62 83.54,64.62 84.91,63.25 84.91,60.73 85.14,60.5 R31.2 85.37,60.5 87.88,60.5 R29.2 88.11,60.5 89.03,60.5 89.48,60.05 89.48,49.53 | 105.49,49.53 105.72,49.53 C16.2 | 105.49,49.53 103.43,49.53 C15.2 103.2,49.53 101.14,49.53 C11.2 100.91,49.3 100.69,49.07 99.09,49.07 R6.2 | C16.2 105.94,49.53 106.63,49.53 109.37,46.79 109.37,37.41 R36.2 109.37,37.19 109.6,36.96 110.97,36.96 127.43,20.5 127.89,20.5 PD_OPT1.1 | 105.49,49.53 113.49,57.53 113.49,61.42 R37.2 113.49,61.65 114.17,61.65 118.97,66.45 126.52,66.45 127.43,67.36 127.89,67.36 SOL1_OSV_5.1 | 105.49,49.53 C16.2 | R4.1 64.8,46.1 64.8,45.41 66.4,43.81 68,43.81 D15.1 68.22,44.04 71.43,44.04 71.65,43.81 71.65,40.84 R43.1 71.65,40.61 72.57,40.61 73.48,39.7 73.48,39.47 74.4,38.56 74.85,38.56 R45.1 75.08,38.79 77.14,38.79 R49.1 77.37,38.79 82.86,38.79 R39.2 83.08,39.01 84.23,39.01 87.66,42.44 87.66,49.53 | U3.5 76,48.62 75.77,48.84 75.77,49.99 76,50.22 U3.3 78.51,50.22 79.2,49.53 85.6,49.53 U3.21 85.83,49.53 87.66,49.53 | R25.2 100.91,58.9 100.69,59.13 99.77,59.13 99.09,58.45 99.09,57.3 R27.2 98.86,57.07 98.86,53.19 R41.2 98.86,52.96 98.86,51.36 C14.2 98.86,51.13 98.86,49.07 R6.2 | R38.2 98.63,42.44 98.63,45.64 R40.2 98.86,45.87 98.86,47.7 | 98.86,47.7 98.86,48.84 R6.2 | 89.48,49.53 93.37,49.53 95.2,47.7 98.86,47.7 | 89.48,49.53 87.66,49.53 | 50.39,9.75 v50.62,9.53
  Bottom 0.305: XB1.10 25.93,100.97 25.93,67.36 20.68,62.1 ETHERNET_1.8 20.45,61.87 20.45,23.01 16.1,18.67 15.42,18.67 13.13,16.38 13.13,15.7 CON2.25 13.13,15.47 13.13,14.55 22.73,4.95 23.88,4.95 25.02,3.81 25.7,3.81 J6.6 25.93,3.81 46.05,3.81 48.56,6.32 48.56,7.47 v50.62,9.53 | 84,7.7 82.17,5.87 PW_IN_24.1 | 84,7.7 89.71,7.7 PD_NPT1.1 93.6,3.81 97.03,3.81 98.86,5.64 103.43,5.64 PD_NPT2.1 103.66,5.64 105.49,3.81 121.49,3.81 122.4,4.72 122.4,8.84 | 126.06,8.84 127.89,8.84 PD_OPT2.1 | 126.06,8.84 122.4,8.84 | 122.4,8.84 118.97,8.84 116.23,6.1 PD_OPT3.1 | 126.06,8.84 126.06,14.55 127.89,16.38 127.89,20.27 PD_OPT1.1 | v82.63,20.27 83.08,19.81 83.08,8.61 84,7.7 | 89.71,104.39 89.71,100.97 90.63,100.05 SW2.P$2 | 89.71,104.39 89.71,105.77 U$2.2 | 89.71,104.39 93.6,104.39 94.97,105.77 105.03,105.77 U$4.2 105.26,105.99 106.4,105.99 113.49,113.08 120.8,113.08 123.77,116.05 129.26,116.05 130.17,115.14 130.17,105.54 128.35,103.71 SCALE.2 | SCALE.2 128.12,103.48 128.12,101.19 SCALE.1 128.35,100.97 128.35,98.68 129.95,97.08 129.95,95.94 128.12,94.11 | SCALE.2 128.12,103.71 122.63,103.71 120.57,105.77 U$5.2 | SOL1_OSV_5.1 128.12,67.59 129.95,69.42 129.95,74.45 128.12,76.28 SOL2_NSV_2.1 128.12,76.51 129.95,78.33 129.95,83.36 128.12,85.19 SOL3_WSV_2.1 128.12,85.42 129.95,87.25 129.95,92.28 128.12,94.11 | 128.12,94.11 SOL4_OSV_4.1
  pour Top: 0.38,0.25 0.13,127.25 135.76,127.25 135.76,0.25
KEY_SW-  (via drill 0.35)
  Top 0.305: v26.62,97.99 21.36,103.25 18.39,103.25 18.16,103.02 ETHERNET3.1 | R5.1 25.02,62.1 25.7,62.1 v26.16,62.56 v27.53,61.19 27.53,55.02 15.88,43.36 14.73,43.36 13.59,42.21 12.22,42.21 11.53,41.53 11.53,20.5 12.22,19.81 13.59,19.81 14.5,18.9 14.5,17.98 15.42,17.07 CON2.12 | v81.26,46.33 82.4,46.33 82.63,46.1 82.63,44.96 U3.14 | v66.85,48.62 v69.37,46.1
  Bottom 0.305: v26.16,62.56 26.16,66.22 27.3,67.36 27.3,97.31 v26.62,97.99 | v81.26,46.33 69.6,46.33 v69.37,46.1 | v66.85,48.62 66.85,50.67 56.34,61.19 v27.53,61.19
N$1
  Bottom 0.305: PW_IN_24.2 84.68,5.64 82.86,3.81 79.2,3.81 76.91,6.1 F1.1A
N$2
  Top 0.305: LED1.A 30.28,2.67 27.3,2.67 26.62,1.98 22.73,1.98 21.59,3.12 21.59,9.3 22.73,10.44 28.22,10.44 29.82,8.84 30.05,8.84 30.28,9.07 R7.2
N$3
  Top 0.305: R42.1 71.43,23.47 71.43,27.58 OK1.1
N$5
  Top 0.305: LED6.A 35.53,4.95 35.53,7.01 R16.1
N$6
  Top 0.305: R15.1 LED5.A
N$7  (via drill 0.35)
  Top 0.305: D4.3 95.2,97.99 98.63,97.99 D5.3 98.86,97.99 99.54,97.99 100.69,99.14 104.12,99.14 v106.86,96.39
  Bottom 0.305: v106.86,96.39 120.35,82.91 120.35,77.65 SOL1_OSV_5.2
N$8  (via drill 0.35)
  Top 0.305: D8.3 53.14,103.48 56.57,103.48 D7.3 56.57,103.71 56.57,106.68 56.34,106.91 56.57,107.14 56.57,107.59 55.65,108.51 55.65,112.17 56.11,112.62 108.23,112.62 v115.32,105.54
  Bottom 0.305: v115.32,105.54 126.06,94.79 126.06,80.85 127.89,79.02 SOL2_NSV_2.2
N$9
  Top 0.305: R34.1 94.06,92.73 94.06,95.48 D4.1 94.06,95.71 94.06,96.62 92.69,97.99 92.69,100.74 90.4,103.02 84.91,103.02 84.23,103.71 83.77,103.71 U$2.COM
N$10
  Top 0.305: D5.1 97.94,95.48 97.94,94.56 98.17,94.34 100.46,94.34 101.14,95.02 101.14,96.39 101.37,96.62 101.37,97.54 Q1.2
N$11  (via drill 0.35)
  Top 0.305: D7.1 57.71,105.99 v57.71,107.59 57.71,108.97 57.48,109.2 R35.1
  Bottom 0.305: v57.71,107.59 58.17,107.59 61.82,103.94 68,103.94 U$3.COM
N$12
  Top 0.305: D8.1 54.05,105.77 54.05,108.74 Q2.2
N$13  (via drill 0.35)
  Top 0.305: D10.3 104.12,36.5 104.12,39.7 D11.3 104.12,39.93 104.12,40.61 v107.77,44.27 | v119.66,80.39 126.98,87.71 127.89,87.71 SOL3_WSV_2.2
  Bottom 0.305: v107.77,44.27 107.77,68.5 v119.66,80.39
N$14  (via drill 0.35)
  Top 0.305: D10.1 101.6,37.19 100.69,37.19 100.46,36.96 100.46,34.44 100.69,34.21 104.12,34.21 105.94,36.04 105.94,36.5 106.86,37.41 107.32,37.41 R36.1 107.54,37.41 107.54,42.9 108.46,43.81 108.46,44.73 v107.09,46.1 | v107.32,94.79 107.32,95.71 107.54,95.94 107.54,96.85 101.37,103.02 100.46,103.02 99.77,103.71 99.09,103.71 U$4.COM
  Bottom 0.305: v107.09,46.1 107.09,53.64 107.32,53.87 v107.32,94.79
N$15
  Top 0.305: D11.1 101.83,40.84 101.83,42.44 Q3.2
N$16
  Top 0.305: D14.3 105.72,59.13 105.72,62.33 D13.3 105.72,62.56 105.72,63.7 118.52,76.51 118.52,88.16 126.98,96.62 127.89,96.62 SOL4_OSV_4.2
N$17  (via drill 0.35)
  Top 0.305: D13.1 108,61.65 111.43,61.65 R37.1 111.66,61.65 111.66,68.73 v121.03,78.11
  Bottom 0.305: v121.03,78.11 121.03,97.31 114.63,103.71 U$5.COM
N$18
  Top 0.305: U3.8 77.14,46.33 70.28,46.33 59.77,56.84 59.77,57.99 59.54,58.22 C13.2 59.31,58.45 58.85,58.45 58.17,59.13 56.79,59.13 56.11,58.45 55.65,58.45 Y2.2
N$19  (via drill 0.35)
  Top 0.305: v75.77,47.02 U3.7 | C12.2 59.99,63.48 57.48,63.48 56.79,64.16 56.57,64.16 55.65,63.25 Y2.1
  Bottom 0.305: v75.77,47.02 71.88,47.02 55.65,63.25 Y2.1
N$20  (via drill 0.35)
  Top 0.305: v77.6,57.07 77.14,57.53 77.14,58.22 R13.2 | v79.65,54.56 80.34,53.87 80.34,53.42 U3.30
  Bottom 0.305: v77.6,57.07 77.6,56.62 v79.65,54.56
N$21  (via drill 0.35)
  Top 0.305: v74.85,57.07 74.85,57.99 R14.2 | v79.2,51.82 79.65,52.27 79.43,52.5 79.43,53.19 U3.31
  Bottom 0.305: v74.85,57.07 74.85,56.16 v79.2,51.82
N$26  (via drill 0.35)
  Top 0.305: v54.05,25.07 52.68,25.07 U4.22 | v41.71,10.21 41.25,9.75 41.25,9.3 R17.1
  Bottom 0.305: v54.05,25.07 53.59,25.07 41.71,13.18 v41.71,10.21
N$27  (via drill 0.35)
  Top 0.305: v54.05,24.16 53.82,24.38 52.68,24.38 U4.23 | v39.19,10.21 38.73,9.75 R18.1
  Bottom 0.305: v54.05,24.16 54.05,16.38 47.19,9.53 39.88,9.53 v39.19,10.21
N$28
  Top 0.305: R18.2 LED8.C
N$29
  Top 0.305: LED7.C 41.25,4.95 41.25,7.01 R17.2
N$30
  Top 0.305: U4.2 59.99,21.87 60.45,21.87 60.68,22.1 60.91,22.1 61.37,21.64 61.82,22.1 C18.1
N$31
  Top 0.305: Q4.2 108,56.39 108,57.76 D14.1
N$32  (via drill 0.35)
  Top 0.305: v70.05,21.41 71.43,21.41 R42.2 | v85.37,19.36 v82.4,19.36 | v121.26,28.5 126.98,34.21 127.89,34.21 LS1_OSV_5.2
  Bottom 0.305: v70.05,21.41 80.34,21.41 v82.4,19.36 | v85.37,19.36 112.12,19.36 v121.26,28.5
N$33
  Top 0.305: R2.1 79.2,23.7 79.2,27.58 OK1.4
N$36  (via drill 0.35)
  Top 0.305: v81.26,29.19 80.34,28.27 80.34,25.76 80.8,25.3 80.8,24.61 80.34,24.16 80.34,22.78 79.43,21.87 79.2,21.87 R2.2 | v116.23,33.53 125.83,43.13 127.89,43.13 LS2_NSV_2.2
  Bottom 0.305: v81.26,29.19 86.06,29.19 97.94,41.07 109.14,41.07 116.23,33.98 v116.23,33.53
N$38
  Top 0.305: R44.1 81.71,23.7 81.71,27.58 OK1.5
N$39  (via drill 0.35)
  Top 0.305: v83.08,24.84 83.08,23.01 81.94,21.87 81.71,21.87 R44.2 | v111.89,37.19 126.75,52.04 127.89,52.04 LS3_WSV_2.2
  Bottom 0.305: v83.08,24.84 86.74,24.84 90.17,21.41 96.11,21.41 v111.89,37.19
N$42
  Top 0.305: R47.1 89.26,23.93 89.26,27.58 OK1.8
N$43  (via drill 0.35)
  Top 0.305: v90.63,22.1 89.48,22.1 R47.2 | v110.06,39.01 110.06,43.59 127.43,60.96 127.89,60.96 LS4_OSV_4.2
  Bottom 0.305: v90.63,22.1 90.63,33.07 98.17,40.61 108.46,40.61 v110.06,39.01
RESET  (via drill 0.35)
  Top 0.305: v80.8,54.56 81.26,54.1 81.03,53.87 81.03,53.42 U3.29 | R12.1 79.2,58.22 v79.2,57.3 v69.83,47.93 | v43.54,4.95 44.22,4.95 44.45,4.72 44.68,4.95 45.59,4.04 50.85,4.04 51.54,4.72 51.77,4.72 54.28,7.24 54.28,7.92 54.05,8.15 54.05,8.38 64.11,18.44 v64.11,20.73 64.11,22.1 C18.2 | v24.79,5.18 24.56,4.95 24.33,4.95 23.19,3.81 J6.5 | v68.68,31.24 70.05,29.87 70.05,26.67 v68,24.61
  Bottom 0.305: v80.8,54.56 79.2,56.16 v79.2,57.3 79.2,57.99 90.63,69.42 90.63,93.42 SW2.P$1 | v43.54,4.95 43.31,4.95 43.08,4.72 26.85,4.72 26.62,4.95 25.02,4.95 v24.79,5.18 | v69.83,47.93 68.68,46.79 v68.68,31.24 | v64.11,20.73 v68,24.61
USB+  (via drill 0.35)
  Top 0.305: v17.93,19.36 16.1,21.18 14.73,21.18 14.05,21.87 14.05,22.78 12.9,23.93 CON2.22 | U4.15 52.45,29.87 52.45,30.1 v51.99,30.56 50.85,30.56 49.94,31.47 49.94,40.61 28.9,61.65 v28.9,62.56 | v48.11,11.58 48.11,9.3 CN2.D+ | v45.14,14.33 44.45,13.64 43.31,13.64 v41.71,15.24 | v27.99,88.16 24.56,91.59 24.56,92.73 21.92,95.89 21.69,96.14 ETHERNET3.6
  Bottom 0.305: 41.71,30.56 29.13,30.56 v17.93,19.36 | 41.71,30.56 v51.99,30.56 | v48.11,11.58 45.36,14.33 v45.14,14.33 | 41.71,30.56 v41.71,15.24 | v27.99,88.16 27.99,85.88 28.9,84.96 v28.9,62.56
USB-  (via drill 0.35)
  Top 0.305: 31.42,29.87 19.3,29.87 16.33,26.9 13.13,26.9 CON2.21 | 31.42,29.87 v42.39,29.87 51.08,29.87 51.77,29.19 52.45,29.19 U4.16 | v47.42,10.9 47.42,9.3 CN2.D- | v42.39,15.93 v43.99,14.33 | v27.99,84.73 26.16,84.73 16.33,94.56 16.33,95.94 16.79,96.39 17.02,96.39 17.93,97.31 17.93,97.77 ETHERNET3.5 | v27.99,62.56 27.99,61.87 31.42,58.45 31.42,29.87
  Bottom 0.305: v43.99,14.33 v47.42,10.9 | v42.39,15.93 42.39,27.13 42.16,27.36 42.16,29.64 v42.39,29.87 | v27.99,62.56 v27.99,84.73
VUSB  (via drill 0.35)
  Top 0.305: 40.79,16.84 41.94,16.84 42.62,17.53 43.31,17.53 C19.1 43.54,17.53 45.59,17.53 C20.2 45.59,17.3 45.59,16.84 46.51,15.93 46.51,9.3 CN2.VBUS | 40.79,16.84 39.88,16.84 D3.A | v19.76,23.7 38.28,23.7 40.79,21.18 40.79,16.84
  Bottom 0.305: 14.96,23.7 13.13,21.87 13.13,21.41 CON2.23 | v19.76,23.7 14.96,23.7 | 14.96,23.7 14.27,24.38 14.27,32.61 13.36,33.53 9.47,33.53 3.99,39.01 3.99,75.13 17.93,89.08 17.93,94.74 ETHERNET3.7

## Text on the board
tPlace: LRA Cold Flow Board REV. A | A6 | 5V | AI00 | 5V | GND | GND | GND | GND | GND | GND | +24V | +24V | +24V | +24V | +24V | AI02 | GND | +24V | GND | GND | GND | GND | AI03 | +24V | AI05 | +24V | AI06 | +24V | AI04 | +24V | GND